# Altium project Pet Pulse.PrjPcb
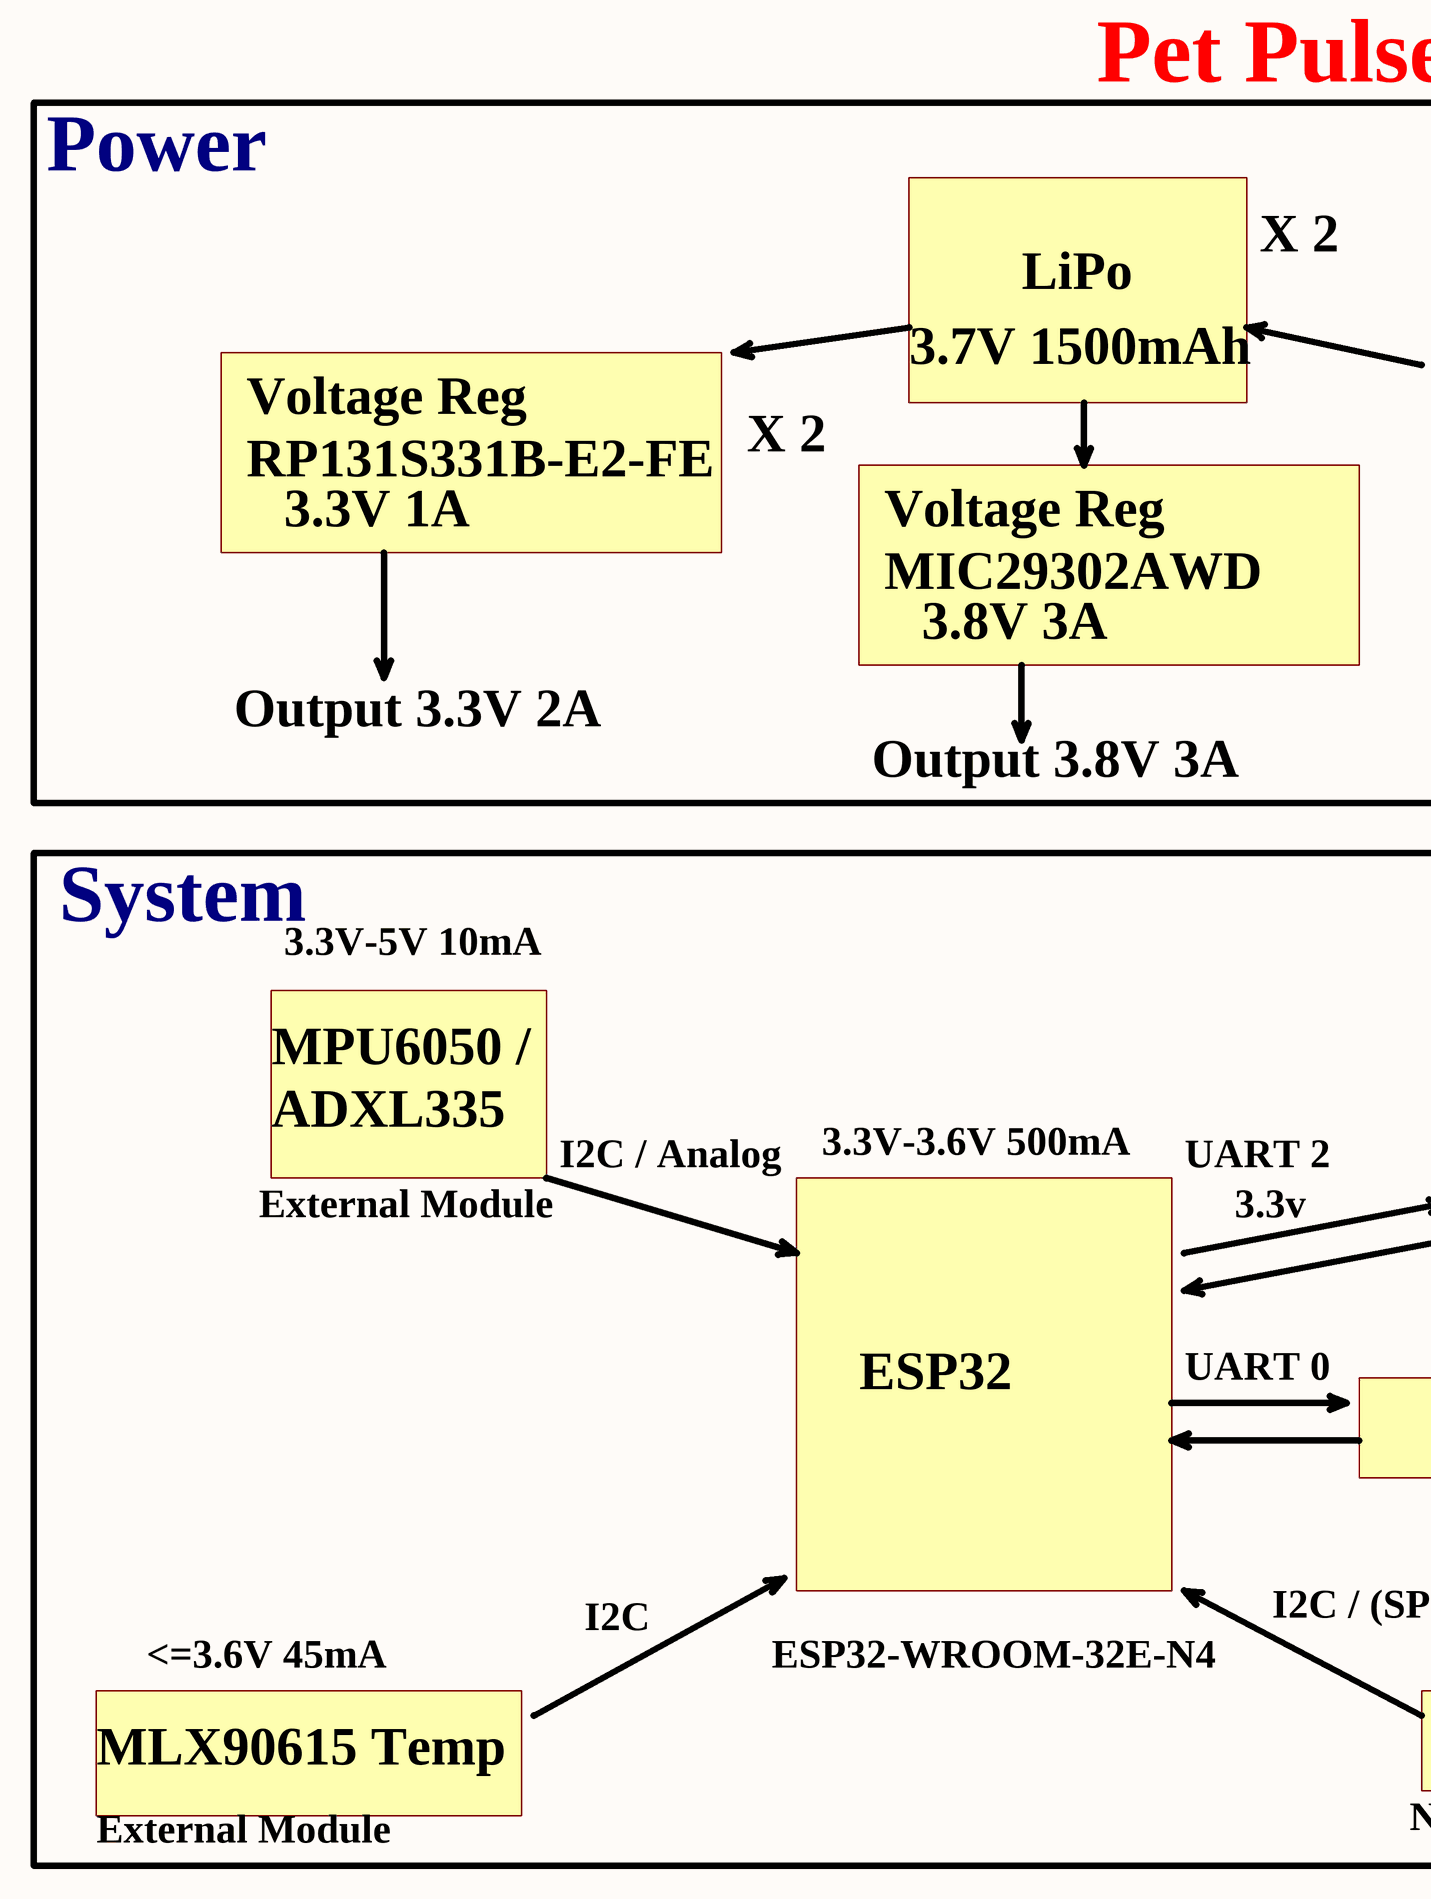
[diagram p0: [01] Block Diagram.SchDoc, left]
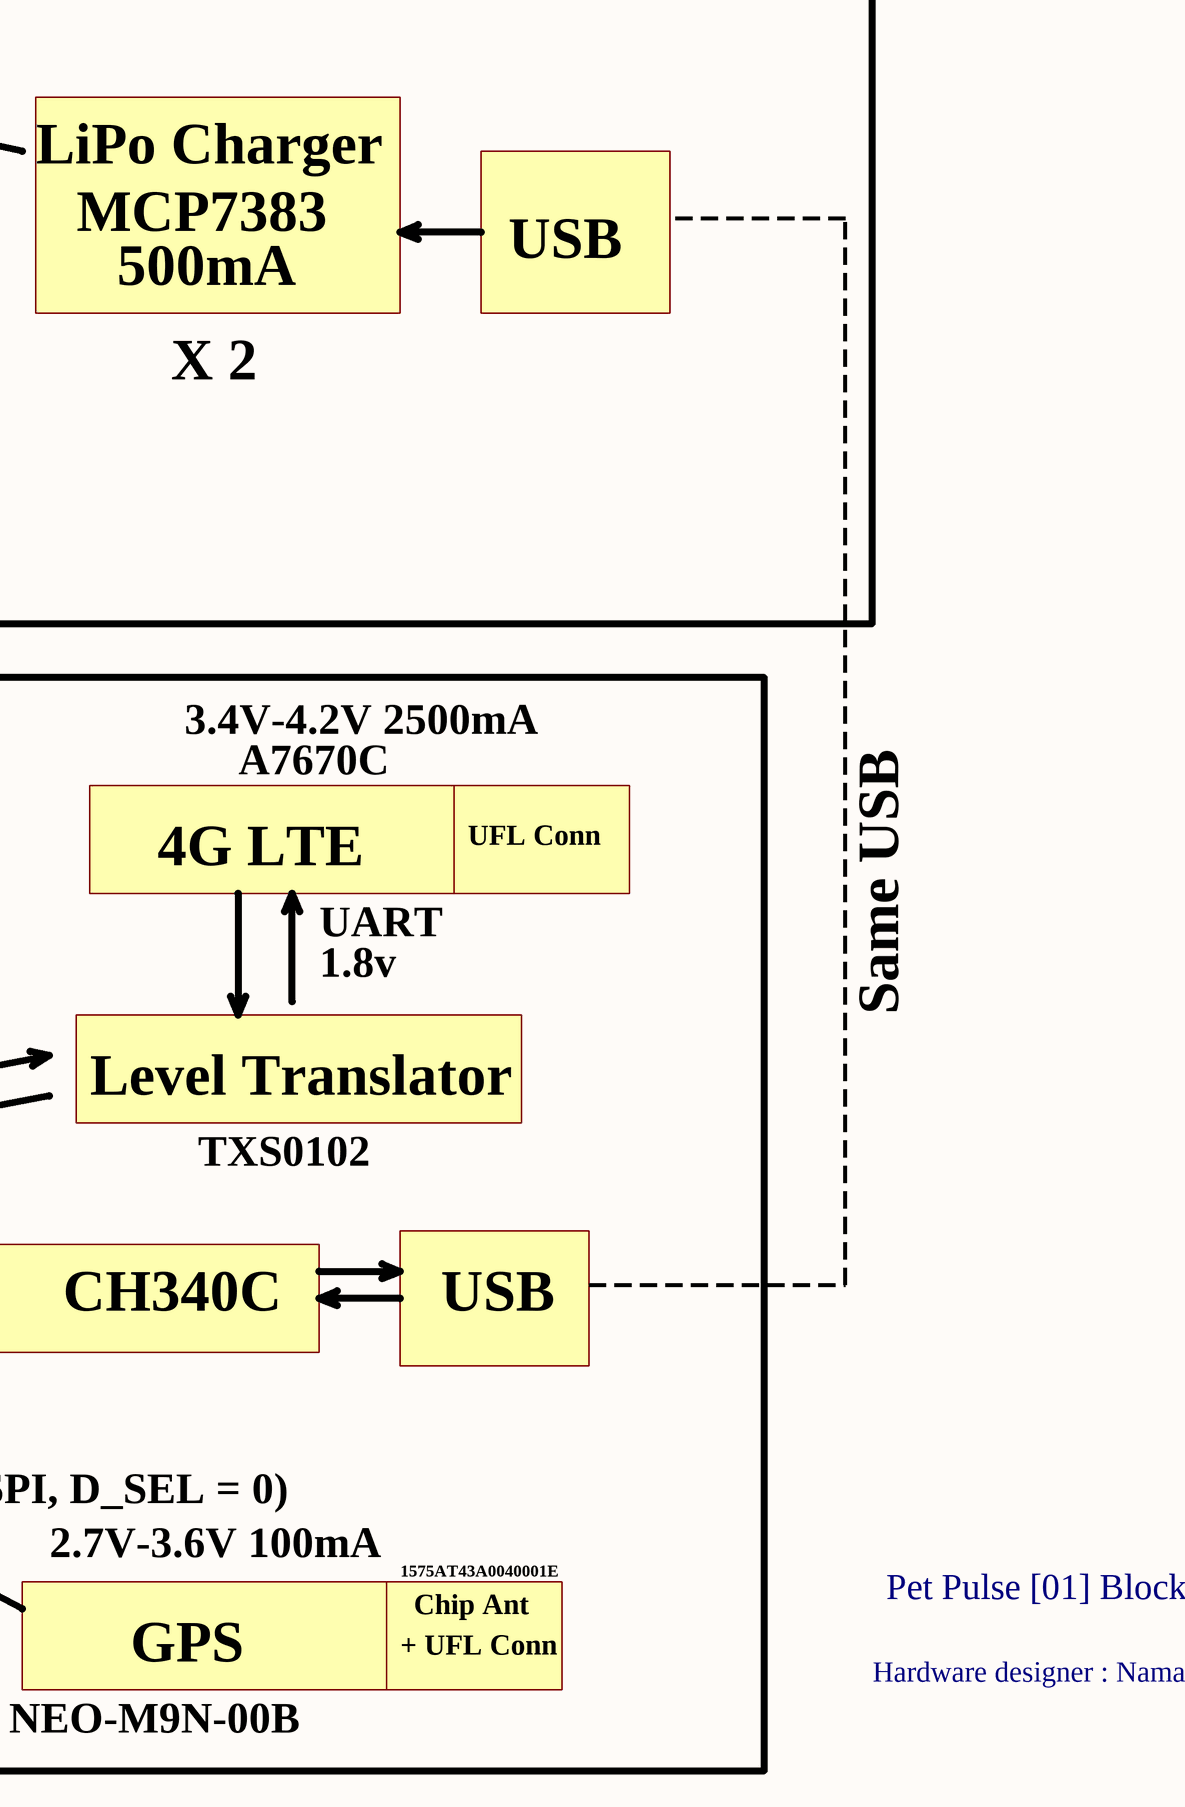
[diagram p1: [01] Block Diagram.SchDoc, right]
6 sheets, 99 parts. Net scope: flat (ports and power ports of the same name join across sheets).
Board file: Pet Pulse PCB.PcbDoc
Sheets:
  [01] Block Diagram.SchDoc
  [02] LDO and LiPo Circuit.SchDoc
  [03] ESP32.SchDoc
  [04] GPS.SchDoc
  [05] External Modules.SchDoc
  [06] LTE - A7670C.SchDoc

## Sheet [01] Block Diagram.SchDoc
size A2; SheetNumber: 1; SheetTotal: 6

### Notes on the sheet
- Pet Pulse
- Power
- LiPo
- X 2
- 3.7V 1500mAh
- Voltage Reg
- LiPo Charger
- RP131S331B-E2-FE
- MCP7383
- 500mA
- USB
- 3.3V 1A
- MIC29302AWD
- 3.8V 3A
- Output 3.3V 2A
- Output 3.8V 3A
- System
- 3.4V-4.2V 2500mA
- 3.3V-5V 10mA
- A7670C
- 4G LTE
- UFL Conn
- MPU6050 /
- UART
- ADXL335
- I2C / Analog
- 3.3V-3.6V 500mA
- UART 2
- 1.8v
- Same USB
- External Module
- 3.3v
- Level Translator
- TXS0102
- ESP32
- UART 0
- CH340C
- I2C / (SPI, D_SEL = 0)
- <=3.6V 45mA
- I2C
- ESP32-WROOM-32E-N4
- 2.7V-3.6V 100mA
- 1575AT43A0040001E
- Chip Ant
- Pet Pulse [01] Block Diagram
- MLX90615 Temp
- GPS
- + UFL Conn
- Hardware designer : Naman Tanwar
- NEO-M9N-00B

## Sheet [02] LDO and LiPo Circuit.SchDoc
size A4; SheetNumber: 2; SheetTotal: 6
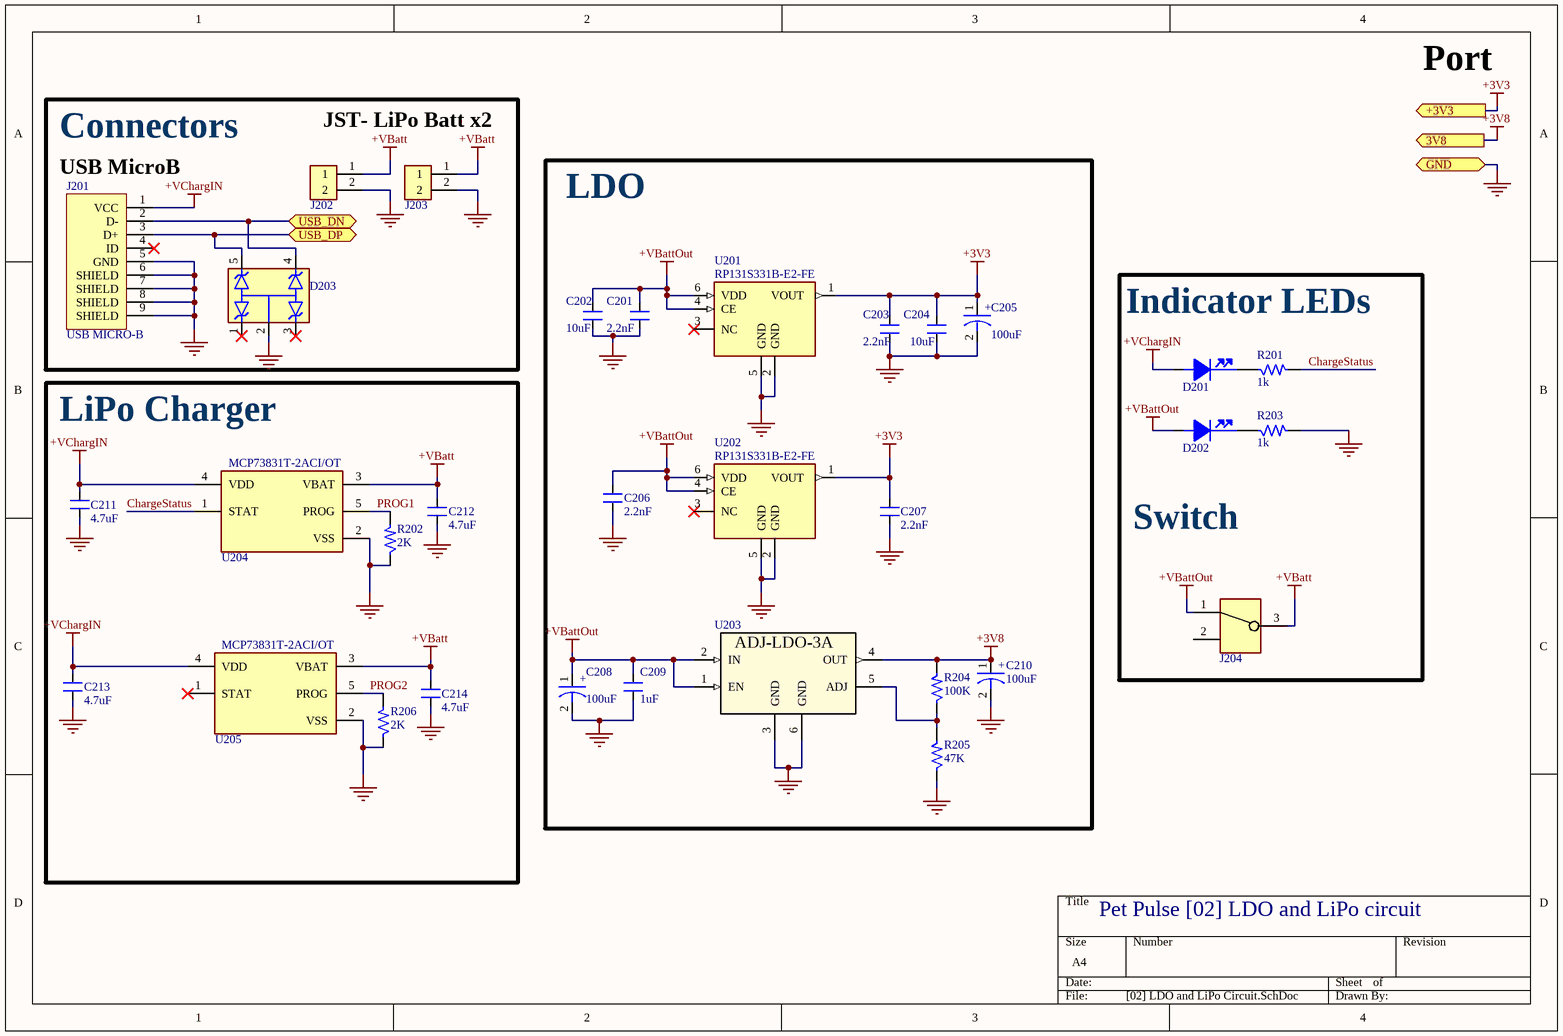
[diagram p2: [02] LDO and LiPo Circuit.SchDoc]

### Parts
C201  2.2nF  [CAP_0805]
C202  10uF  [CAP_1206]
C203  2.2nF  [CAP_0805]
C204  10uF  [CAP_1206]
C205  100uF  [ACAP_P236_D305_H303_RAD]
C206  2.2nF  [CAP_0805]
C207  2.2nF  [CAP_0805]
C208  100uF  [ACAP_P236_D305_H303_RAD]
C209  1uF  [CAP_0805]
C210  100uF  [ACAP_P236_D305_H303_RAD]
C211  4.7uF  [CAP_0805]
C212  4.7uF  [CAP_0805]
C213  4.7uF  [CAP_0805]
C214  4.7uF  [CAP_0805]
D201  LED 0805 ORANGE  [LED_0805]  (value not drawn)
D202  LED 0805 ORANGE  [LED_0805]  (value not drawn)
D203  ESDA6V1W5  [SOT-323-5]  (value not drawn)
J201  USB MICRO-B  [CON_USB2.0_MICROB-SMD]
J202  1x2 JST  [CON-JST-1X2-1.5-M-TH]  (value not drawn)
J203  1x2 JST  [CON-JST-1X2-1.5-M-TH]  (value not drawn)
J204  SW1_SlideSW_SMD_SPDT_450405020524  [SW1_SlideSW_SMD_SPDT_450405020524]  (value not drawn)
R201  1k  [RES_0805]
R202  2K  [RES_0805]
R203  1k  [RES_0805]
R204  100K  [RES_0805]
R205  47K  [RES_0805]
R206  2K  [RES_0805]
U201  RP131S331B-E2-FE  [6HSOP]
U202  RP131S331B-E2-FE  [6HSOP]
U203  MIC29302AWD  [TO-252-5_MCH]  (value not drawn)
U204  MCP73831T-2ACI/OT  [SOT-23-5_MC_MCH]
U205  MCP73831T-2ACI/OT  [SOT-23-5_MC_MCH]

### Blocks framed on the sheet
Connectors: D203 J201-J203
LDO: C201-C210 R204 R205 U201-U203
LiPo Charger: C211-C214 R202 R206 U204 U205

### Ports
3V8 (out, see [05] External Modules[4D], [06] LTE - A7670C[8A]), +3V3 (out, see [03] ESP32[2C], [04] GPS[4B], [05] External Modules[4C], [06] LTE - A7670C[8A]), GND (bidir, see [03] ESP32[2C], [04] GPS[4B], [05] External Modules[4D], [06] LTE - A7670C[8A]), USB_DN (bidir, see [03] ESP32[1D]), USB_DP (bidir, see [03] ESP32[1D])

### Nets
+3V3: C203.1 C204.2 C205.1 C207.1 U201.1(VOUT) U202.1(VOUT) ; port +3V3
+3V8: C210.1 R204.2 U203.4(OUT) ; port 3V8
+VBatt: C212.2 C214.2 J202.1 J203.1 J204.3 U204.3(VBAT) U205.3(VBAT)
+VBattOut: C201.1 C202.2 C206.1 C208.1 C209.2 D202.2(Anode) J204.1 U201.4(CE) U201.6(VDD) U202.4(CE) U202.6(VDD) U203.1(EN) U203.2(IN)
+VChargIN: C211.2 C213.2 D201.2(Anode) J201.1(VCC) U204.4(VDD) U205.4(VDD)
GND: C201.2 C202.1 C203.2 C204.1 C205.2 C206.2 C207.2 C208.2 C209.1 C210.2 C211.1 C212.1 C213.1 C214.1 D203.2 J201.5(GND) J201.6(SHIELD) J201.7(SHIELD) J201.8(SHIELD) J201.9(SHIELD) J202.2 J203.2 R202.1 R203.2 R205.1 R206.1 U201.2(GND) U201.5(GND) U202.2(GND) U202.5(GND) U203.3(GND) U203.6(GND) U204.2(VSS) U205.2(VSS) ; port GND
ChargeStatus: R201.2 U204.1(STAT)
PROG1: R202.2 U204.5(PROG)
PROG2: R206.2 U205.5(PROG)
USB_D_N: D203.4 J201.2(D-) ; port USB_DN
USB_D_P: D203.5 J201.3(D+) ; port USB_DP
NetD201_1: D201.1(Cathode) R201.1
NetD202_1: D202.1(Cathode) R203.1
NetR204_1: R204.1 R205.2 U203.5(ADJ)

Not connected (* = marked no-connect by the designer): D203 1* 3*; J201 4(ID)*; J204 2; U201 3(NC)*; U202 3(NC)*; U205 1(STAT)*

### Notes on the sheet
- Port
- (near J201) USB MicroB
- JST- LiPo Batt x2
- Indicator LEDs
- Switch
- Pet Pulse [02] LDO and LiPo circuit
- (in symbol CAP-P_100uF-25V-20%-RAD) +
- (in symbol REG_LDO_ADJ_3A_MIC29302AWD) ADJ-LDO-3A

### Library data of the parts
C201 C203 C206 C207 = CAP_2.2nF-50V-10%-0805: 2200pF ±10% 50V Ceramic Capacitor C0G, NP0 0805 (2012 Metric); Manufacturer: YAGEO; Manufacturer Part Number: CC0805KRX7R9BB222; Alternate Part Number-1: NA; Case/Package: 0805
C202 C204 = CAP_10uF-50V-10%-1206: 10µF ±10% 50V Ceramic Capacitor X7R 1206 (3216 Metric); Manufacturer: KEMET; Manufacturer Part Number: CL31B106KBHNNNE; Alternate Part Number-1: GRT31CR61H106ME01L; Case/Package: 1206; Supplier-1: SIRICOM; Supplier Part Number-1: CC1206KKX5R9BB106
C205 C208 C210 = CAP-P_100uF-25V-20%-RAD: 100µF 25V Aluminum Electrolytic Capacitors Radial, Can - SMD 1000 Hrs @ 105°C; Manufacturer: Nichicon; Manufacturer Part Number: UWT1E101MCL1GS; Alternate Part Number-1: NA; Case/Package: Radial-SMD; Supplier-1: SP ROAD; Supplier Part Number-1: UWT1E101MCL1GS
C209 = CAP_1uF-50V-5%-0805: 1µF ±5% 50V Ceramic Capacitor X7R 0805 (2012 Metric); Manufacturer: Samsung; Manufacturer Part Number: CC0805JKX7R9BB105; Alternate Part Number-1: 0805F105M500NT; Case/Package: 0805; Supplier-1: SIRICOM; Supplier Part Number-1: CL21B105KBFNNNE
C211-C214 = CAP_4.7uF-50V-10%-0805: 4.7µF ±10% 50V Ceramic Capacitor X5R 0805 (2012 Metric); Manufacturer: Yageo; Manufacturer Part Number: GRM21BR61H475KE51L; Alternate Part Number-1: NA; Case/Package: 0805; Supplier-1: SIRICOM; Supplier Part Number-1: CL21A475KBQNNNE
D201 D202 = LED_ORANGE-2V-20mA- 0805: Orange LED 0805 Vf = 2V, 20mA; Manufacturer: Osram Opto; Manufacturer Part Number: LOR976-PS-1; Lens Color: White; Viewing Angle: 160°; Lens Style: Flat,Rectangular,Diffused,Colorless; Forward Current: 25mA; Luminous Intensity: 162.5mcd; Dominant Wavelength: 606nm; Luminous Flux: 0.735lm; Reverse Voltage: 12V; Lens Transparency: Diffused; Number of LEDs: 1; Lens Size: 1.25mm; Supplier 1: Arrow Electronics; RoHS: Yes; Category: LEDs; Stock 1: 2418; Pricing 1: 1=0.27100, 10=0.15400, 25=0.15270, 100=0.07290, 250=0.07210, 500=0.06600, 1000=0.05150 (USD); Mount: Surface Mount; Case/Package: 0805; Number of Pins: 2; Color: Orange; Case Code (Metric): 2012; Case Code (Imperial): 0805; Contact Plating: Tin,Matte; Min Operating Temperature: -30°C; Max Operating Temperature: 85°C; Packaging: Tape and Reel; Forward Voltage: 2V; Test Current: 20mA; Package Quantity: 16000; Illumination Color: Orange; Series: CHIPLED 0805; Length: 2mm; Width: 1.25mm; Height: 0.9mm; Radiation Hardening: No; RoHS Compliant: Yes; ComponentLink1URL: https://datasheet.ciiva.com/2119/00078881-0-2119287.pdf?src-supplier=Digi-Key; ComponentLink1Description: https://datasheet.ciiva.com/2119/00078881-0-2119287.pdf?src-supplier=Digi-Key; ComponentLink2URL: https://datasheet.ciiva.com/2119/00078881-0-2119286.pdf?src-supplier=Digi-Key; ComponentLink2Description: https://datasheet.ciiva.com/2119/00078881-0-2119286.pdf?src-supplier=Digi-Key; ComponentLink3URL: https://datasheet.ciiva.com/2119/00078881-0-2119288.pdf?src-supplier=Digi-Key; ComponentLink3Description: https://datasheet.ciiva.com/2119/00078881-0-2119288.pdf?src-supplier=Digi-Key; Supplier Part Number 1: LO R976-PS-1
D203 = DIO_TVS_ARRY_3Vrm_6.1Vbr_ESDA6V1W5: Tvs Diode Array 3V reverse standoff, 6.1V reverse breakdown.  SOT-323-5; Manufacturer: STMicroelectronics; Manufacturer Part Number: ESDA6V1W5; Case/Package: SOT-323-5
J201 = CON_USB2.0_MICROB-SMD: USB - micro B USB 2.0 Receptacle Connector 5 Position Surface Mount, Right Angle; Manufacturer: ICC; Manufacturer Part Number: 10118192-0001LF; Alternate Part Number-1: NA; Case/Package: USB MICRO-B SMD; Supplier-1: SUNROM; Supplier Part Number-1: MICRO USB
J202 J203 = CON-JST-1X2-1.5-M-TH: Connector Header Through Hole 2 position 0.059" (1.50mm); Manufacturer: JST Sales America Inc.; Manufacturer Part Number: B2B-ZR (LF)(SN); Supplier 1: Digi-Key; Category: Headers and Wire Housings; Supplier Part Number 1: 455-B2B-ZR-ND; ComponentLink1Description: DigiKey; ComponentLink1URL: https://www.digikey.in/en/products/detail/jst-sales-america-inc/B2B-ZR/926564
J204 = SW1_SlideSW_SMD_SPDT_450405020524: Slide Switch SPDT Surface Mount; Manufacturer: Würth Elektronik; Manufacturer Part Number: 450405020524; Case/Package: SMT
R201 R203 = RES_1K- 0.125W-5%-0805: RES 1K OHM 5% 1/8W 0805; Manufacturer Part Number: RC0805JR-131KL; Manufacturer: YAGEO; Alternate Part Number: NA; Case/Package: 0805
R202 R206 = RES_2K-0.125W-1%-0805: 2 kOhms ±1% 0.125W, 1/8W Chip Resistor 0805 (2012 Metric) Moisture Resistant Thick Film; Manufacturer: TE Connectivity; Manufacturer Part Number: RC0805FR-072KL; Alternate Part Number-1: NA; Case/Package: 0805; Supplier-1: SIRICOM; Supplier Part Number-1: WR08X2001FTL
R204 = RES_100K-0.125W-1%-0805: 100 kOhms ±1% 0.125W, 1/8W Chip Resistor 0805 (2012 Metric) Automotive AEC-Q200 Thick Film; Manufacturer: Walsin; Manufacturer Part Number: WR08X1003FTL; Alternate Part Number-1: NA; Case/Package: 0805; Supplier-1: SIRICOM; Supplier Part Number-1: WR08X1003FTL
R205 = RES_47K-0.125W-1%-0805: 47 kOhms ±1% 0.125W, 1/8W Chip Resistor 0805 (2012 Metric) Moisture Resistant Thick Film; Manufacturer: YAGEO; Manufacturer Part Number: RC0805FR-0747KL; Case/Package: 0805
U201 U202 = REG_LDO_3.3V_1A_RP131S331B-E2-FE: LDO 3.3V Output 1A 6-HSOP-J; Manufacturer: Nisshinbo Micro Devices Inc.; Manufacturer Part Number: RP131S331B-E2-FE; Case/Package: 6HSOP
U203 = REG_LDO_ADJ_3A_MIC29302AWD: Linear Voltage Regulator IC Positive Adjustable 1 Output 3A TO-252-5; Microchip Technology: Microchip; Manufacturer Part Number: MIC29302AWD; Case/Package: TO-252-5
U204 U205 = IC_BATT_CNTL_LI-ION-1CELL: Charger IC Lithium Ion/Polymer SOT-23-5; Manufacturer: Microchip; Manufacturer Part Number: MCP73831T-2ACI/OT; Case/Package: SOT-23-5

## Sheet [03] ESP32.SchDoc
size A4; SheetNumber: 3; SheetTotal: 6
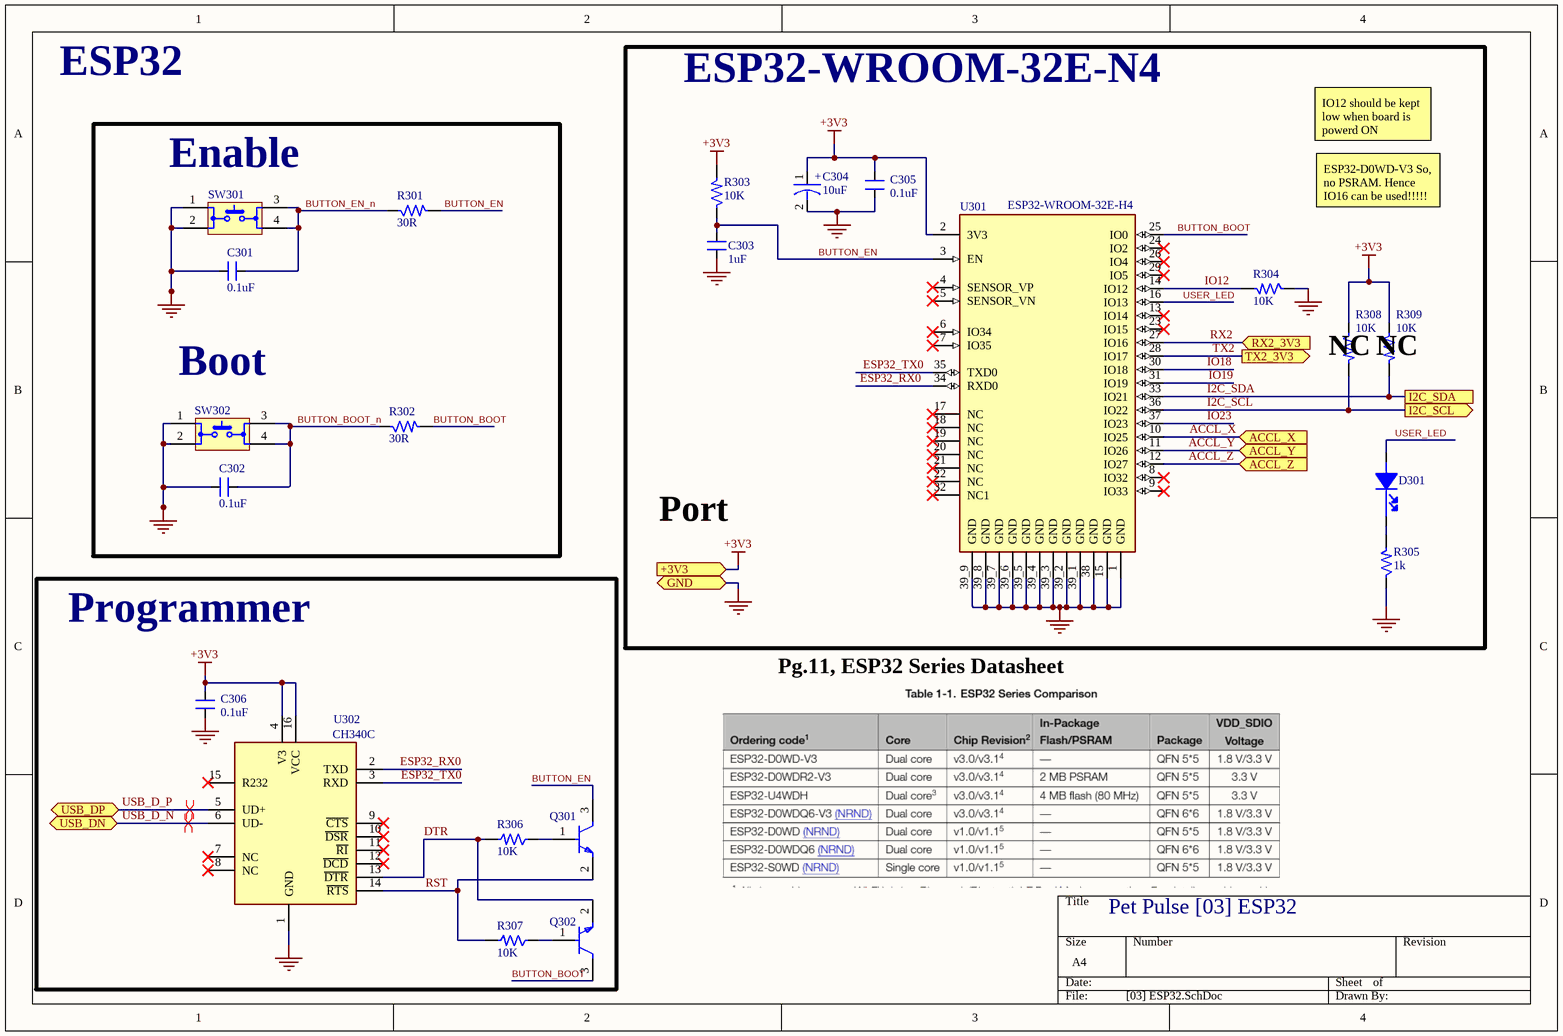
[diagram p3: [03] ESP32.SchDoc]

### Parts
C301  0.1uF  [CAP_0805]
C302  0.1uF  [CAP_0805]
C303  1uF  [CAP_0805]
C304  10uF  [CAP-T_1206]
C305  0.1uF  [CAP_0805]
C306  0.1uF  [CAP_0805]
D301  LED 0805 ORANGE  [LED_0805]  (value not drawn)
Q301  MMBT3904-7-F  [FP-SOT23-MFG]  (value not drawn)
Q302  MMBT3904-7-F  [FP-SOT23-MFG]  (value not drawn)
R301  30R  [RES_0805]
R302  30R  [RES_0805]
R303  10K  [RES_0805]
R304  10K  [RES_0805]
R305  1k  [RES_0805]
R306  10K  [RES_0805]
R307  10K  [RES_0805]
R308  10K  [RES_0805]
R309  10K  [RES_0805]
SW301  SW1_SMD_TL3305AF260QG  [SW_TL3305AF260QG]  (value not drawn)
SW302  SW1_SMD_TL3305AF260QG  [SW_TL3305AF260QG]  (value not drawn)
U301  ESP32-WROOM-32E-H4  [MOD_ESP32-WROOM-32E_(4MB_HIGH_TEMP)]
U302  CH340C  [SOIC16_50_284_25X90_SMT]

### Blocks framed on the sheet
ESP32-WROOM-32E-N4: C303-C305 D301 R303-R305 R308 R309 U301
Programmer: C306 Q301 Q302 R306 R307 U302

### Ports
+3V3 (in, see [02] LDO and LiPo Circuit[4A], [04] GPS[4A], [05] External Modules[4A], [06] LTE - A7670C[8A]), ACCL_X (in, see [05] External Modules[2B]), ACCL_Y (in, see [05] External Modules[2B]), ACCL_Z (in, see [05] External Modules[2B]), GND (bidir, see [02] LDO and LiPo Circuit[4A], [04] GPS[4A], [05] External Modules[4A], [06] LTE - A7670C[8A]), I2C_SCL (out, see [04] GPS[1B], [05] External Modules[3B]), I2C_SDA (see [04] GPS[1B], [05] External Modules[3B]), RX2_3V3 (in, see [06] LTE - A7670C[6B]), TX2_3V3 (out, see [06] LTE - A7670C[6B]), USB_DN (bidir, see [02] LDO and LiPo Circuit[1A]), USB_DP (bidir, see [02] LDO and LiPo Circuit[1A])

### Nets
+3V3: C304.1 C305.2 C306.2 R303.2 R308.1 R309.1 U301.2(3V3) U302.4(V3) U302.16(VCC) ; port +3V3
GND: C301.2 C302.2 C303.1 C304.2 C305.1 C306.1 R304.1 R305.1 SW301.1 SW301.2 SW302.1 SW302.2 U301.1(GND) U301.15(GND) U301.38(GND) U301.39_1(GND) U301.39_2(GND) U301.39_3(GND) U301.39_4(GND) U301.39_5(GND) U301.39_6(GND) U301.39_7(GND) U301.39_8(GND) U301.39_9(GND) U302.1(GND) ; port GND
ACCL_X: U301.10(IO25) ; port ACCL_X
ACCL_Y: U301.11(IO26) ; port ACCL_Y
ACCL_Z: U301.12(IO27) ; port ACCL_Z
BUTTON_BOOT: Q302.3(C) R302.2 U301.25(IO0)
BUTTON_BOOT_n: C302.1 R302.1 SW302.3 SW302.4
BUTTON_EN: C303.2 Q301.3(C) R301.2 R303.1 U301.3(EN)
BUTTON_EN_n: C301.1 R301.1 SW301.3 SW301.4
DTR: Q302.2(E) R306.2 U302.13(~{DTR})
ESP32_RX0: U301.34(RXD0) U302.2(TXD)
ESP32_TX0: U301.35(TXD0) U302.3(RXD)
I2C_SCL: R308.2 U301.36(IO22) ; port I2C_SCL
I2C_SDA: R309.2 U301.33(IO21) ; port I2C_SDA
IO12: R304.2 U301.14(IO12)
IO18: U301.30(IO18)
IO19: U301.31(IO19)
IO23: U301.37(IO23)
RST: Q301.2(E) R307.2 U302.14(~{RTS})
RX2: U301.27(IO16) ; port RX2_3V3
TX2: U301.28(IO17) ; port TX2_3V3
USB_D_N: U302.6(UD-) ; port USB_DN
USB_D_P: U302.5(UD+) ; port USB_DP
USER_LED: D301.2(Anode) U301.16(IO13)
NetD301_1: D301.1(Cathode) R305.2
NetQ301_1: Q301.1(B) R306.1
NetQ302_1: Q302.1(B) R307.1

Not connected (* = marked no-connect by the designer): U301 4(SENSOR_VP)* 5(SENSOR_VN)* 6(IO34)* 7(IO35)* 8(IO32)* 9(IO33)* 13(IO14)* 17(NC)* 18(NC)* 19(NC)* 20(NC)* 21(NC)* 22(NC)* 23(IO15)* 24(IO2)* 26(IO4)* 29(IO5)* 32(NC1)*; U302 7(NC)* 8(NC)* 9(~{CTS})* 10(~{DSR})* 11(~{RI})* 12(~{DCD})* 15(R232)*

### Layout directives
differential pair; differential pair class DIFF90: USB_D_N, USB_D_P

### Notes on the sheet
- ESP32
- (near SW301) Enable
- IO12 should be kept low when board is powerd ON
- ESP32-D0WD-V3 So, no PSRAM. Hence IO16 can be used!!!!!
- (near SW302) Boot
- (near R308) NC
- (near R309) NC
- Port
- Pg.11, ESP32 Series Datasheet
- Pet Pulse [03] ESP32
- (in symbol CAP-P_10uF-16V-10%-1206) +

### Library data of the parts
C301 C302 C305 C306 = CAP_0.1uF-50V-10%-0805: 0.1µF ±10% 50V Ceramic Capacitor X7R 0805 (2012 Metric); Manufacturer: Samsung; Manufacturer Part Number: CL21B104KBCNNNC; Alternate Part Number-1: NA; Case/Package: 0805; Supplier-1: SIRICOM; Supplier Part Number-1: 0805B104K500CT
C303 = CAP_1uF-50V-5%-0805: as C209 on sheet [02] LDO and LiPo Circuit; Case/Package: 0805; Supplier-1: SIRICOM; Supplier Part Number-1: CL21B105KBFNNNE
C304 = CAP-P_10uF-16V-10%-1206: 10µF Molded Tantalum Capacitors 16V 1206 (3216 Metric) 3Ohm; Manufacturer: AVX Corporation; Manufacturer Part Number: TAJA106K016SNJ; Alternate Part Number-1: CA45-A016K106T; Case/Package: 1206; Supplier-1: SIRICOM; Supplier Part Number-1: TAJA106K016SNJ
D301 = LED_ORANGE-2V-20mA- 0805: as D201 on sheet [02] LDO and LiPo Circuit; Supplier 1: Arrow Electronics; RoHS: Yes; Category: LEDs; Stock 1: 2418; Pricing 1: 1=0.27100, 10=0.15400, 25=0.15270, 100=0.07290, 250=0.07210, 500=0.06600, 1000=0.05150 (USD); Mount: Surface Mount; Case/Package: 0805; Number of Pins: 2; Color: Orange; Case Code (Metric): 2012; Case Code (Imperial): 0805; Contact Plating: Tin,Matte; Min Operating Temperature: -30°C; Max Operating Temperature: 85°C; Packaging: Tape and Reel; Forward Voltage: 2V; Test Current: 20mA; Package Quantity: 16000; Illumination Color: Orange; Series: CHIPLED 0805; Length: 2mm; Width: 1.25mm; Height: 0.9mm; Radiation Hardening: No; RoHS Compliant: Yes; ComponentLink1URL: https://datasheet.ciiva.com/2119/00078881-0-2119287.pdf?src-supplier=Digi-Key; ComponentLink1Description: https://datasheet.ciiva.com/2119/00078881-0-2119287.pdf?src-supplier=Digi-Key; ComponentLink2URL: https://datasheet.ciiva.com/2119/00078881-0-2119286.pdf?src-supplier=Digi-Key; ComponentLink2Description: https://datasheet.ciiva.com/2119/00078881-0-2119286.pdf?src-supplier=Digi-Key; ComponentLink3URL: https://datasheet.ciiva.com/2119/00078881-0-2119288.pdf?src-supplier=Digi-Key; ComponentLink3Description: https://datasheet.ciiva.com/2119/00078881-0-2119288.pdf?src-supplier=Digi-Key; Supplier Part Number 1: LO R976-PS-1
Q301 Q302 = TRANS_NPN_MMBT3904: TRANS NPN 40V 0.2A SMD SOT23-3; Manufacturer: Diodes Incorporated; Frequency: 300MHz; Power Dissipation: 350mW; Element Configuration: Single; Max Power Dissipation: 300mW; Max Collector Current: 200mA; Collector Emitter Saturation Voltage: 300mV; Number of Elements: 1; hFE Min: 100; Collector Base Voltage (VCBO): 60V; Emitter Base Voltage (VEBO): 6V; Contact Plating: Tin; Package Quantity: 3000; Max Frequency: 300MHz; REACH SVHC: No SVHC; Max Operating Temperature: 150°C; Width: 1.4mm; Collector Emitter Voltage (VCEO): 40V; Voltage Rating (DC): 40V; Radiation Hardening: No; Case/Package: SOT-23; Height: 1mm; Collector Emitter Breakdown Voltage: 40V; Length: 3.05mm; Polarity: NPN; Packaging: Tape and Reel; Number of Pins: 3; Min Operating Temperature: -55°C; Gain Bandwidth Product: 300MHz; Mount: Surface Mount; Weight: 0.000282oz; Continuous Collector Current: 200mA; Transition Frequency: 300MHz; Max Breakdown Voltage: 40V; Lead Free: Lead Free; Manufacturer Part Number: MMBT3904-7-F
R301 R302 = RES_30R-0.125W-5%-0805: 30 Ohms ±5% 0.125W, 1/8W Chip Resistor 0805 (2012 Metric) Moisture Resistant Thick Film; Manufacturer: Stackpole Electronics; Manufacturer Part Number: RC0805JR-0730RL; Alternate Part Number-1: NA; Case/Package: 0805; Supplier-1: SIRICOM; Supplier Part Number-1: WR08X30R0FTL
R303 R304 R306-R309 = RES_10K-0.125W-1%-0805: 10 kOhms ±1% 0.125W, 1/8W Chip Resistor 0805 (2012 Metric) Automotive AEC-Q200 Thick Film; Manufacturer: CTS; Manufacturer Part Number: WR08X1002FTL; Case/Package: 0805; Supplier-1: SIRICOM; Supplier Part Number-1: WR08X1002FTL; Alternate Part Number-1: WR08X1002FTL
R305 = RES_1K- 0.125W-5%-0805: as R201 on sheet [02] LDO and LiPo Circuit; Case/Package: 0805
SW301 SW302 = SW1_SMD_TL3305AF260QG: Tactile Switch SPST SMD; Manufacturer: E-Switch; Manufacturer Part Number: TL3305AF260QG; Case/Package: SMD
U301 = MOD-ESP32-WROOM-32E-H4: Rx Txrx Mod Wifi Trace Ant SMD; Manufacturer: Espressif Systems; Supplier 1: Digi-Key; Manufacturer Part Number: ESP32-WROOM-32E-H4; RoHS: No; Category: Uncategorized; Stock 1: 12159; Pricing 1: 1=3.15000 (USD); Supplier Part Number 1: 1965-ESP32-WROOM-32E-H4CT-ND
U302 = IC_CH340C: USB Bridge, USB to UART USB 2.0 UART Interface; Manufacturer: Olimex; Alternate Part Number-1: NA; Manufacturer Part Number: CH340C; Case/Package: SOIC16; Supplier-1: LCSC; Supplier Part Number-1: C84681

## Sheet [04] GPS.SchDoc
size A4; SheetNumber: 4; SheetTotal: 6
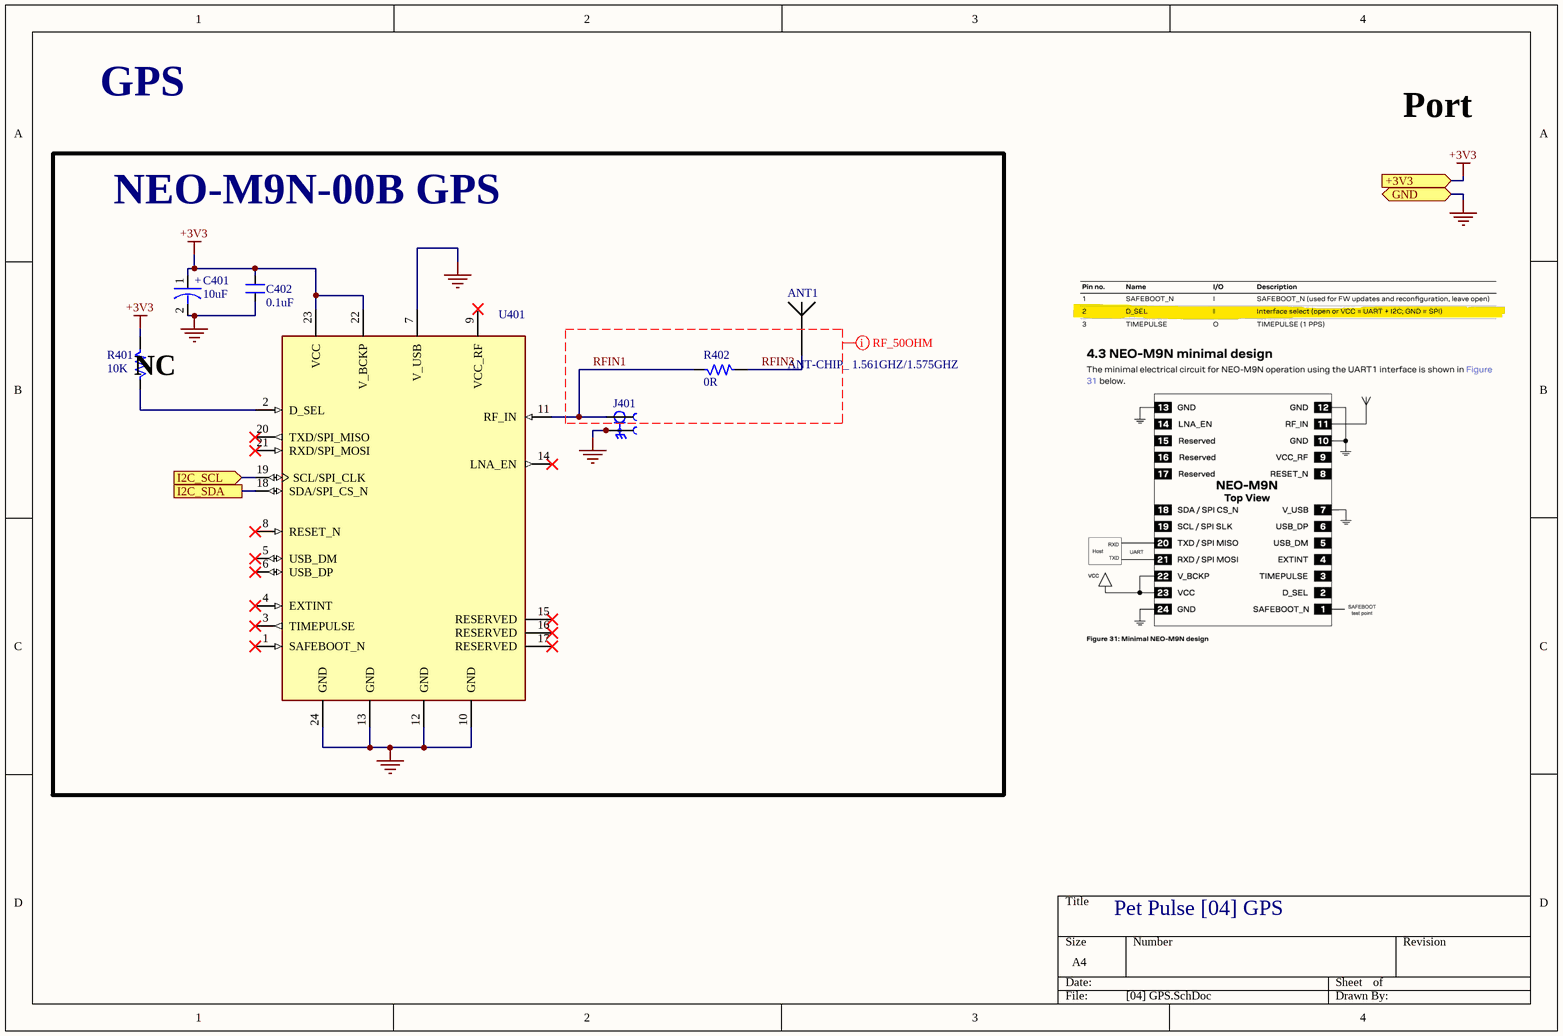
[diagram p4: [04] GPS.SchDoc]

### Parts
ANT1  ANT-CHIP_ 1.561GHZ/1.575GHZ  [ANT_1575AT43A0040001E]
C401  10uF  [CAP-T_1206]
C402  0.1uF  [CAP_0805]
J401  CON_UFL-SMD-T  [CON-UFL-SMD-T]  (value not drawn)
R401  10K  [RES_0805]
R402  0R  [RES_0603]
U401  IC_GPS/GNSS_NEO-M9N-00B  [IC_NEO-M9N-00B]  (value not drawn)

### Ports
+3V3 (in, see [02] LDO and LiPo Circuit[4A], [03] ESP32[2C], [05] External Modules[4A], [06] LTE - A7670C[8A]), GND (bidir, see [02] LDO and LiPo Circuit[4A], [03] ESP32[2C], [05] External Modules[4A], [06] LTE - A7670C[8A]), I2C_SCL (in, see [03] ESP32[4B], [05] External Modules[3B]), I2C_SDA (see [03] ESP32[4B], [05] External Modules[3B])

### Nets
+3V3: C401.1 C402.2 R401.2 U401.22(V_BCKP) U401.23(VCC) ; port +3V3
GND: C401.2 C402.1 J401.2 J401.3 U401.7(V_USB) U401.10(GND) U401.12(GND) U401.13(GND) U401.24(GND) ; port GND
I2C_SCL: U401.19(SCL/SPI_CLK) ; port I2C_SCL
I2C_SDA: U401.18(SDA/SPI_CS_N) ; port I2C_SDA
RFIN1: J401.1 R402.1 U401.11(RF_IN)
RFIN2: ANT1.1 R402.2
NetR401_1: R401.1 U401.2(D_SEL)

Not connected (* = marked no-connect by the designer): U401 1(SAFEBOOT_N)* 3(TIMEPULSE)* 4(EXTINT)* 5(USB_DM)* 6(USB_DP)* 8(RESET_N)* 9(VCC_RF)* 14(LNA_EN)* 15(RESERVED)* 16(RESERVED)* 17(RESERVED)* 20(TXD/SPI_MISO)* 21(RXD/SPI_MOSI)*

### Layout directives
net class RF_50: RFIN1, RFIN2

### Notes on the sheet
- GPS
- Port
- NEO-M9N-00B GPS
- (near R401) NC
- Pet Pulse [04] GPS
- (in symbol CAP-P_10uF-16V-10%-1206) +

### Library data of the parts
ANT1 = ANT-CHIP_ 1.561GHZ/1.575GHZ: Manufacturer: Johanson Technology Inc.; Manufacturer Part Number: 1575AT43A0040E; Case/Package: SMD
C401 = CAP-P_10uF-16V-10%-1206: as C304 on sheet [03] ESP32; Case/Package: 1206; Supplier-1: SIRICOM; Supplier Part Number-1: TAJA106K016SNJ
C402 = CAP_0.1uF-50V-10%-0805: as C301 on sheet [03] ESP32; Case/Package: 0805; Supplier-1: SIRICOM; Supplier Part Number-1: 0805B104K500CT
J401 = CON_UFL-SMD-T: U.FL (UMCC) Connector Jack, Male Pin 50Ohm Surface Mount Solder; MP: CONUFL001-SMD-T; MF: Linx; Price: None; Package: None; Value: *; Check_prices: https://www.snapeda.com/parts/CONUFL001-SMD-T/Linx/view-part/?ref=eda; Availability: Unavailable; SnapEDA_Link: https://www.snapeda.com/parts/CONUFL001-SMD-T/Linx/view-part/?ref=snap
R401 = RES_10K-0.125W-1%-0805: as R303 on sheet [03] ESP32; Case/Package: 0805; Supplier-1: SIRICOM; Supplier Part Number-1: WR08X1002FTL; Alternate Part Number-1: WR08X1002FTL
R402 = RES_0R-0.1W-0603: 0 Ohms 0603 (1608 Metric); Manufacturer: Stackpole Electronics Inc; Manufacturer Part Number: RMCF0603ZT0R00; Alternate Part Number-1: NA; Case/Package: 0603; Supplier-1: Digi-Key; Supplier Part Number-1: RMCF0603ZT0R00CT-ND
U401 = IC_GPS/GNSS_NEO-M9N-00B: M9 RF Receiver BeiDou, Galileo, GLONASS, GNSS, GPS -167dBm Module; Manufacturer: u-blox; Manufacturer Part Number: NEO-M9N-00B; Case/Package: SMD

## Sheet [05] External Modules.SchDoc
size A4; SheetNumber: 5; SheetTotal: 6
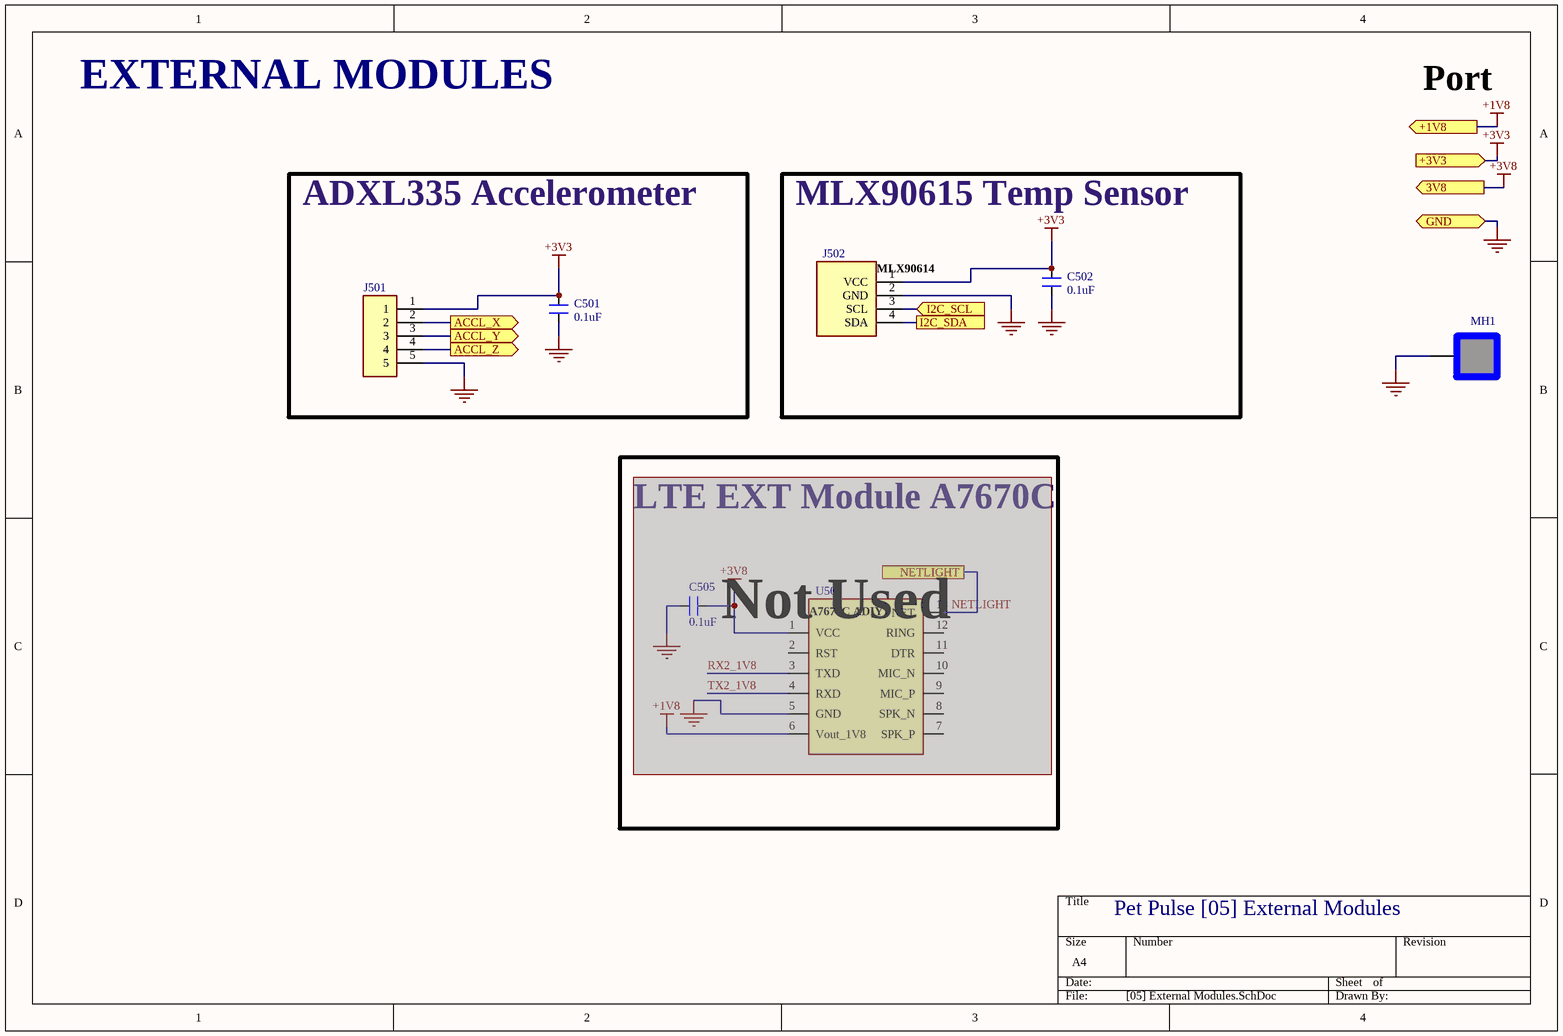
[diagram p5: [05] External Modules.SchDoc]

### Parts
C501  0.1uF  [CAP_0805]
C502  0.1uF  [CAP_0805]
C505  0.1uF  [CAP_0805]  (masked out: inside a compile mask, not in the netlist)
J501  1X5 Berg Male  [CON-BS-SMD-1X5-2.54-M-TH]  (value not drawn)
J502  1X4 Berg Male With MLX90614 3D Body  [MOD_IR_MLX90614_WITH_CON-BS-SMD-1X4-2.54-M-TH]  (value not drawn)
MH1  MH_Square_4MMC_2.2MMD  [MH_Square_4mm_2.2mmD]  (value not drawn)  (no BOM)
U502  A7670C_MOD  [MOD_ADIY_A7670C_BreakoutBoard]  (value not drawn)  (masked out: inside a compile mask, not in the netlist)

### Blocks framed on the sheet
ADXL335 Accelerometer: C501 J501
MLX90615 Temp Sensor: C502 J502
Not Used: C505 U502

### Ports
3V8 (out, see [02] LDO and LiPo Circuit[4A], [06] LTE - A7670C[8A]), +1V8 (out, see [06] LTE - A7670C[8B]), +3V3 (in, see [02] LDO and LiPo Circuit[4A], [03] ESP32[2C], [04] GPS[4A], [06] LTE - A7670C[8A]), ACCL_X (out, see [03] ESP32[4B]), ACCL_Y (out, see [03] ESP32[4B]), ACCL_Z (out, see [03] ESP32[4B]), GND (bidir, see [02] LDO and LiPo Circuit[4A], [03] ESP32[2C], [04] GPS[4A], [06] LTE - A7670C[8A]), I2C_SCL (in, see [03] ESP32[4B], [04] GPS[1B]), I2C_SDA (see [03] ESP32[4B], [04] GPS[1B]), NETLIGHT (see [06] LTE - A7670C[1D], [06] LTE - A7670C[4B])

### Nets
+3V3: C501.2 C502.2 J501.1 J502.1(VCC) ; port +3V3
GND: C501.1 C502.1 J501.5 J502.2(GND) MH1.1 ; port GND
ACCL_X: J501.2 ; port ACCL_X
ACCL_Y: J501.3 ; port ACCL_Y
ACCL_Z: J501.4 ; port ACCL_Z
I2C_SCL: J502.3(SCL) ; port I2C_SCL
I2C_SDA: J502.4(SDA) ; port I2C_SDA

### Notes on the sheet
- EXTERNAL MODULES
- Port
- LTE EXT Module A7670C
- Pet Pulse [05] External Modules
- (in symbol MOD-ADIY_A7670C_LTE_Breakout_Board) A7670C ADIY
- (in symbol MOD_IR_MLX90614_WITH_CON-BS-SMD-1X4-2.54-M-TH) MLX90614

### Library data of the parts
C501 C502 = CAP_0.1uF-50V-10%-0805: as C301 on sheet [03] ESP32; Case/Package: 0805; Supplier-1: SIRICOM; Supplier Part Number-1: 0805B104K500CT
C505 = CAP_0.1uF-50V-5%-0805: 0.1µF ±5% 50V Ceramic Capacitor X7R 0805 (2012 Metric); Manufacturer: AVX Corporation; Manufacturer Part Number: 08055C104JAT4A; Alternate Part Number-1: 0805B104M500; Case/Package: 0805; Supplier-1: SIRICOM; Supplier Part Number-1: 0805B104J500CT
J501 = CON-BS-SMD-1X5-2.54-M-TH_1: 1X5 Berg Strip SMD Male Conn 2.54mm; Manufacturer: Amphenol Communications Solutions; Manufacturer Part Number: 10129380-905001ALF; Supplier 1: Digi-Key; RoHS: No; Category: Connectors; Stock 1: 5335; Pricing 1: 1=1.00000, 10=0.84300, 100=0.75660, 500=0.61902 (USD); Supplier Part Number 1: 609-4535-1-ND
J502 = MOD_IR_MLX90614_WITH_CON-BS-SMD-1X4-2.54-M-TH: 1X4 Berg Strip SMD Male Conn 2.54mm with 3D body of MLX90614 IR Temperature Sensor; Manufacturer: Amphenol Communications Solutions; Manufacturer Part Number: 10129380-904001ALF; Supplier 1: Digi-Key; RoHS: No; Category: Connectors; Stock 1: 5335; Pricing 1: 1=1.00000, 10=0.84300, 100=0.75660, 500=0.61902 (USD); Supplier Part Number 1: 609-4535-1-ND
MH1 = MH_Square_4MMC_2.2MMD: Mounting Hole 4mm Side, 2.2mm Drill
U502 = MOD-ADIY_A7670C_LTE_Breakout_Board: ADIY LTE Module A7670C

## Sheet [06] LTE - A7670C.SchDoc
size A3; SheetNumber: 6; SheetTotal: 6
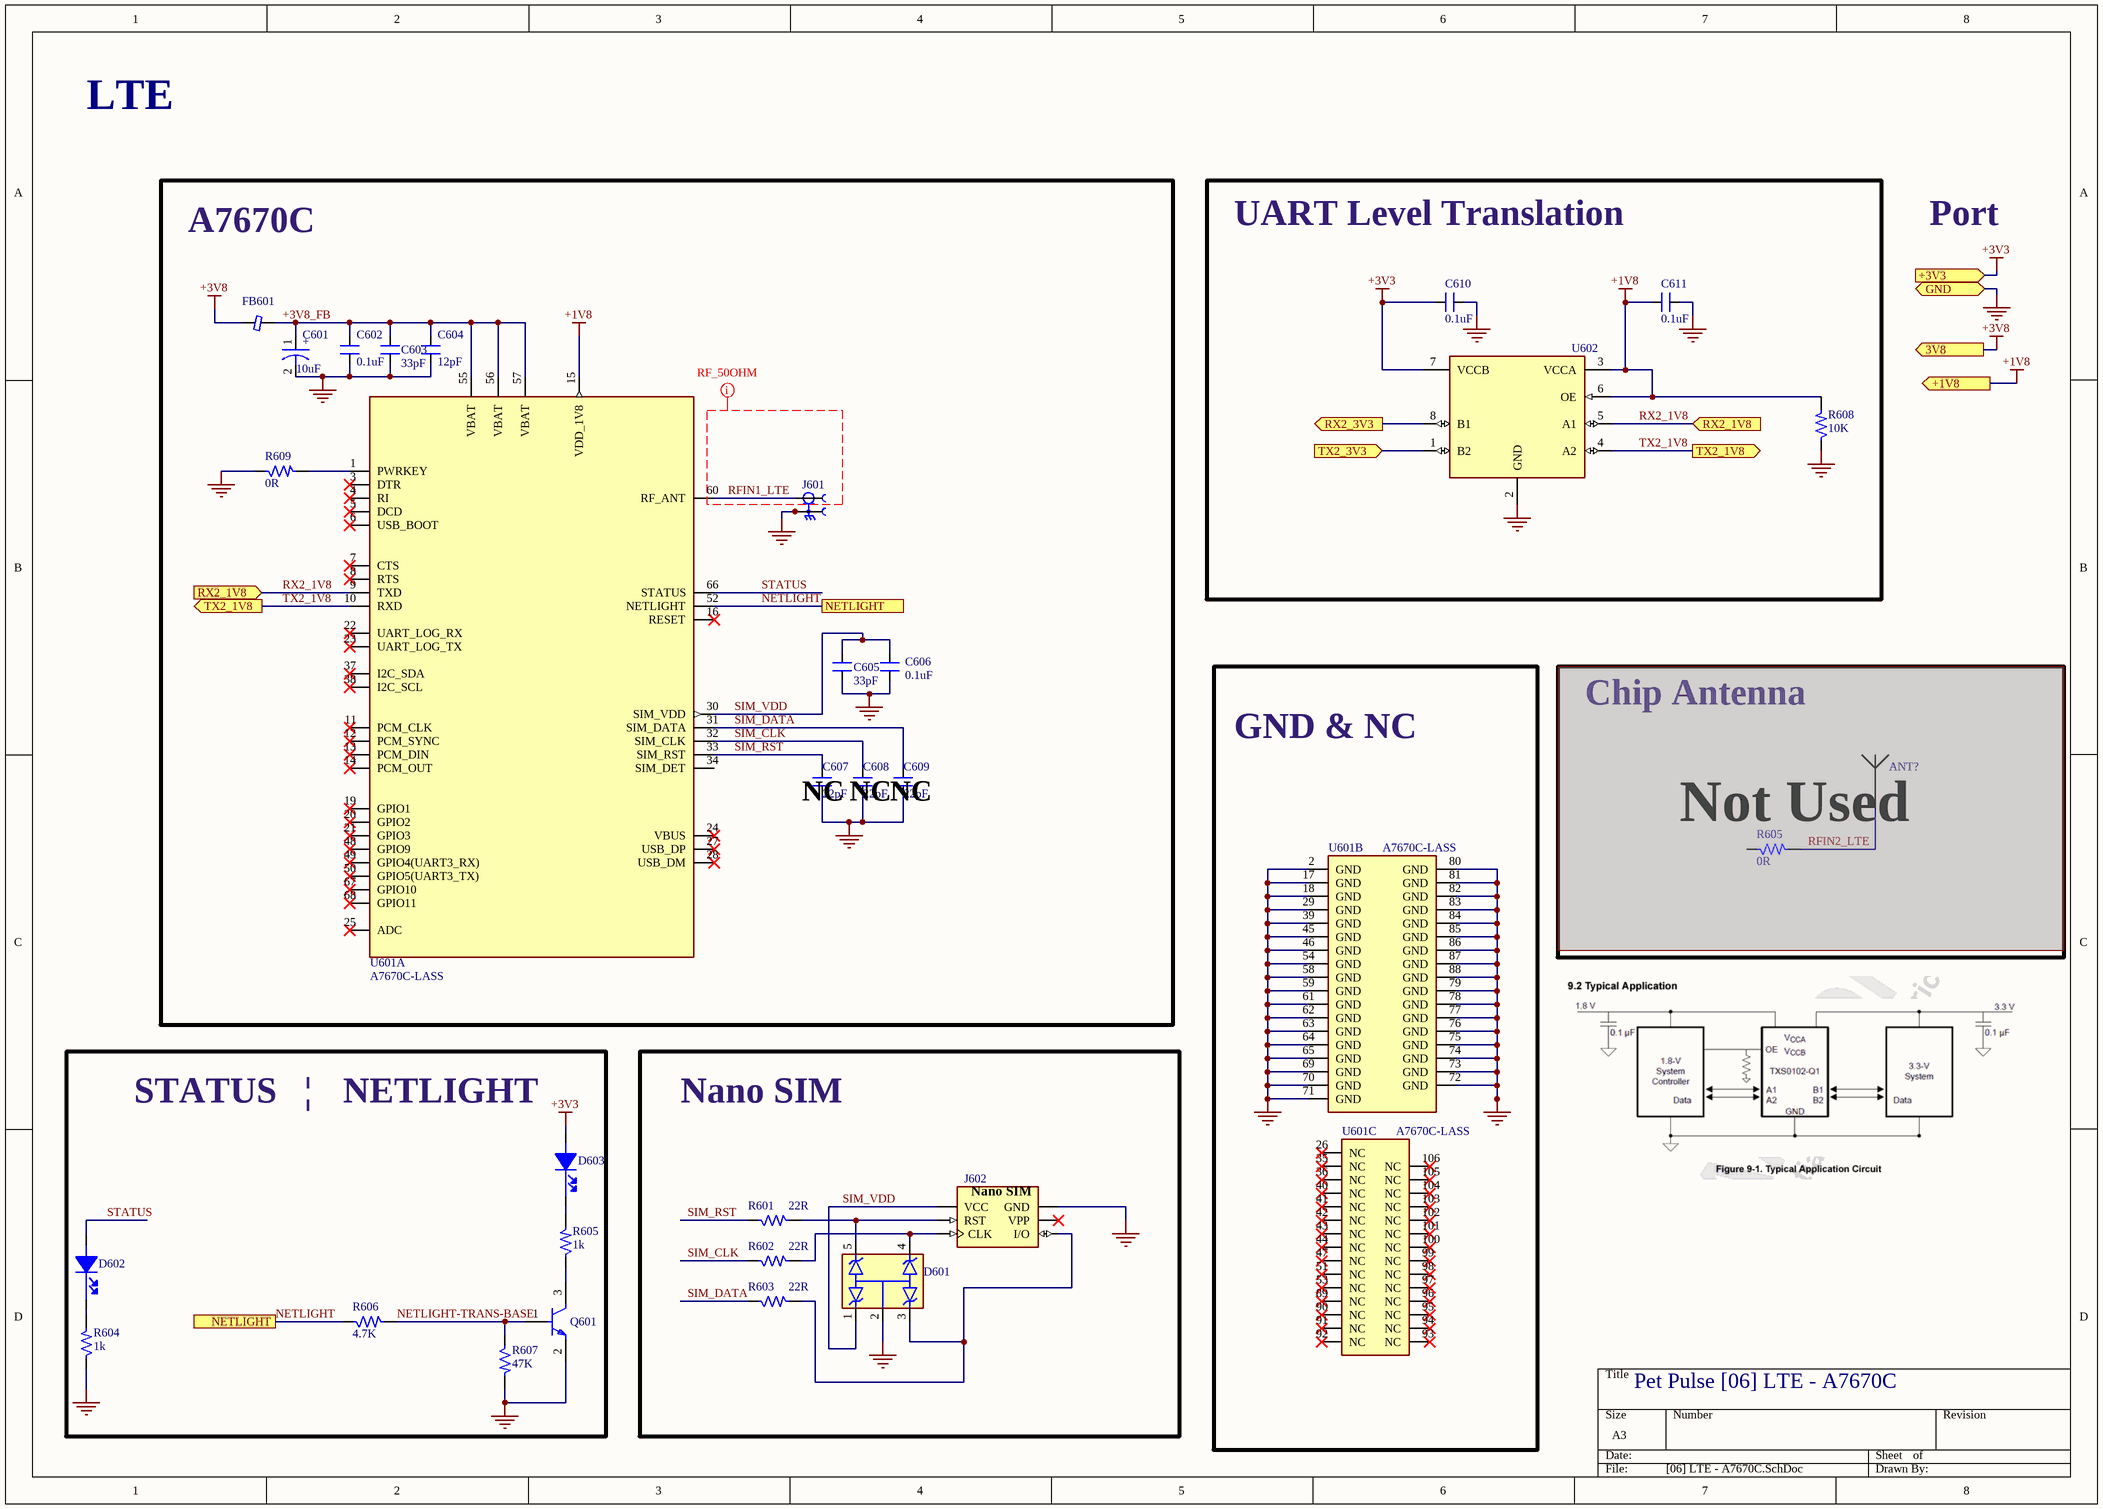
[diagram p6: [06] LTE - A7670C.SchDoc]

### Parts
(Parts that share a designator on the sheet are numbered #1, #2 ... from top to bottom, then left to right.)
ANT?  NN02-201  [ANT_Ignion_NN02-201]  (value not drawn)  (masked out: inside a compile mask, not in the netlist)
C601  10uF  [CAP-T_1206]
C602  0.1uF  [CAP_0805]
C603  33pF  [CAP_0805]
C604  12pF  [CAP_0805]
C605  33pF  [CAP_0805]
C606  0.1uF  [CAP_0805]
C607  22pF  [CAP_0805]
C608  22pF  [CAP_0805]
C609  22pF  [CAP_0805]
C610  0.1uF  [CAP_0805]
C611  0.1uF  [CAP_0805]
D601  ESDA6V1W5  [SOT-323-5]  (value not drawn)
D602  LED 0805 ORANGE  [LED_0805]  (value not drawn)
D603  LED 0805 ORANGE  [LED_0805]  (value not drawn)
FB601  MPZ2012S221AT000  [FB_0805]  (value not drawn)
J601  CON_UFL-SMD-T  [CON-UFL-SMD-T]  (value not drawn)
J602  SIM8051-6-0-14-01-A  [GCT_SIM8051-6-0-14-01-X-REVD]  (value not drawn)
Q601  MMBT3904-7-F  [FP-SOT23-MFG]  (value not drawn)
R601  22R  [RES_0805]
R602  22R  [RES_0805]
R603  22R  [RES_0805]
R604  1k  [RES_0805]
R605#1  0R  [RES_0603]  (masked out: inside a compile mask, not in the netlist)
R605#2  1k  [RES_0805]
R606  4.7K  [RES_0805]
R607  47K  [RES_0805]
R608  10K  [RES_0805]
R609  0R  [RES_0603]
U601  A7670C-LASS  [LTE_CHIP_A7670C-LASS]  (parts A,B,C of 3)
U602  TXS0102DCTR  [SOP65P400X130-8N]  (value not drawn)

### Blocks framed on the sheet
A7670C: C601-C609 FB601 J601 R609 U601
UART Level Translation: C610 C611 R608 U602
GND & NC: U601
Not Used: ANT? R605#1
Nano SIM: D601 J602 R601-R603

### Ports
3V8 (out, see [02] LDO and LiPo Circuit[4A], [05] External Modules[4A]), +1V8 (out, see [05] External Modules[4A]), +3V3 (in, see [02] LDO and LiPo Circuit[4A], [03] ESP32[2C], [04] GPS[4A], [05] External Modules[4A]), GND (bidir, see [02] LDO and LiPo Circuit[4A], [03] ESP32[2C], [04] GPS[4A], [05] External Modules[4A]), NETLIGHT (see [06] LTE - A7670C[1D]), NETLIGHT (see [06] LTE - A7670C[4B]), RX2_1V8 (in, see [06] LTE - A7670C[1B]), RX2_1V8 (in, see [06] LTE - A7670C[7B]), RX2_3V3 (out, see [03] ESP32[4B]), TX2_1V8 (out, see [06] LTE - A7670C[1B]), TX2_1V8 (out, see [06] LTE - A7670C[7B]), TX2_3V3 (in, see [03] ESP32[4B])

### Nets
+1V8: C611.2 R608.2 U601.15(VDD_1V8) U602.3(VCCA) U602.6(OE) ; port +1V8
+3V3: C610.2 D603.2(Anode) U602.7(VCCB) ; port +3V3
+3V8: FB601.1 ; port 3V8
GND: C601.2 C602.1 C603.1 C604.1 C605.1 C606.1 C607.1 C608.1 C609.1 C610.1 C611.1 D601.2 J601.2 J601.3 J602.C5(GND) Q601.2(E) R604.1 R607.2 R608.1 R609.1 U601.2(GND) U601.17(GND) U601.18(GND) U601.29(GND) U601.39(GND) U601.45(GND) U601.46(GND) U601.54(GND) U601.58(GND) U601.59(GND) U601.61(GND) U601.62(GND) U601.63(GND) U601.64(GND) U601.65(GND) U601.69(GND) U601.70(GND) U601.71(GND) U601.72(GND) U601.73(GND) U601.74(GND) U601.75(GND) U601.76(GND) U601.77(GND) U601.78(GND) U601.79(GND) U601.80(GND) U601.81(GND) U601.82(GND) U601.83(GND) U601.84(GND) U601.85(GND) U601.86(GND) U601.87(GND) U601.88(GND) U602.2(GND) ; port GND
+3V8_FB: C601.1 C602.2 C603.2 C604.2 FB601.2 U601.55(VBAT) U601.56(VBAT) U601.57(VBAT)
NETLIGHT: R606.1 U601.52(NETLIGHT) ; port NETLIGHT
NETLIGHT-TRANS-BASE: Q601.1(B) R606.2 R607.1
RFIN1_LTE: J601.1 U601.60(RF_ANT)
RX2: U602.8(B1) ; port RX2_3V3
RX2_1V8: U601.9(TXD) U602.5(A1) ; port RX2_1V8
SIM_CLK: C608.2 R602.1 U601.32(SIM_CLK)
SIM_DATA: C609.2 R603.1 U601.31(SIM_DATA)
SIM_RST: C607.2 R601.1 U601.33(SIM_RST)
SIM_VDD: C605.2 C606.2 D601.1 J602.C1(VCC) U601.30(SIM_VDD)
STATUS: D602.2(Anode) U601.66(STATUS)
TX2: U602.1(B2) ; port TX2_3V3
TX2_1V8: U601.10(RXD) U602.4(A2) ; port TX2_1V8
NetD601_3: D601.3 J602.C7(I/O) R603.2
NetD601_4: D601.4 J602.C3(CLK) R602.2
NetD601_5: D601.5 J602.C2(RST) R601.2
NetD602_1: D602.1(Cathode) R604.2
NetD603_1: D603.1(Cathode) R605#2.2
NetQ601_3: Q601.3(C) R605#2.1
NetR609_2: R609.2 U601.1(PWRKEY)

Not connected (* = marked no-connect by the designer): J602 C6(VPP)*; U601 3(DTR)* 4(RI)* 5(DCD)* 6(USB_BOOT)* 7(CTS)* 8(RTS)* 11(PCM_CLK)* 12(PCM_SYNC)* 13(PCM_DIN)* 14(PCM_OUT)* 16(RESET)* 19(GPIO1)* 20(GPIO2)* 21(GPIO3)* 22(UART_LOG_RX)* 23(UART_LOG_TX)* 24(VBUS)* 25(ADC)* 26(NC)* 27(USB_DP)* 28(USB_DM)* 34(SIM_DET) 35(NC)* 36(NC)* 37(I2C_SDA)* 38(I2C_SCL)* 40(NC)* 41(NC)* 42(NC)* 43(NC)* 44(NC)* 47(NC)* 48(GPIO9)* 49(GPIO4(UART3_RX))* 50(GPIO5(UART3_TX))* 51(NC)* 53(NC)* 67(GPIO10)* 68(GPIO11)* 89(NC)* 90(NC)* 91(NC)* 92(NC)* 93(NC)* 94(NC)* 95(NC)* 96(NC)* 97(NC)* 98(NC)* 99(NC)* 100(NC)* 101(NC)* 102(NC)* 103(NC)* 104(NC)* 105(NC)* 106(NC)*

### Layout directives
net class RF_50: RFIN1_LTE

### Notes on the sheet
- LTE
- Port
- Chip Antenna
- (near C607) NC
- (near C608) NC
- (near C609) NC
- STATUS   |
- NETLIGHT
- Pet Pulse [06] LTE - A7670C
- (in symbol CAP-P_10uF-16V-10%-1206) +
- (in symbol CON_NanoSIM_6Pin_SIM8051-6-0-14-01-A) Nano SIM

### Library data of the parts
ANT? = ANT-CHIP_Cellular_UltraWideBand_Ignion_NN02-201: ONE MXTEND MULTIBAND ANTENNA; Manufacturer: Ignion; Manufacturer Part Number: NN02-201; Case/Package: SMD
C601 = CAP-P_10uF-16V-10%-1206: as C304 on sheet [03] ESP32; Case/Package: 1206; Supplier-1: SIRICOM; Supplier Part Number-1: TAJA106K016SNJ
C602 C606 C610 C611 = CAP_0.1uF-50V-10%-0805: as C301 on sheet [03] ESP32; Case/Package: 0805; Supplier-1: SIRICOM; Supplier Part Number-1: 0805B104K500CT
C603 C605 = CAP_33pF-50V-5%-0805: 33pF ±5% 50V Ceramic Capacitor C0G/NPO 0805 (2012 Metric); Manufacturer: YAGEO; Manufacturer Part Number: CC0805JRNPO9BN330; Alternate Part Number-1: NA; Case/Package: 0805
C604 = CAP_12pF-50V-5%-0805: 12pF ±5% 50V Ceramic Capacitor C0G, NP0 0805 (2012 Metric); Manufacturer: KEMET; Manufacturer Part Number: CC0805JRNPO9BN120; Alternate Part Number-1: NA; Case/Package: 0805; Supplier-1: SIRICOM; Supplier Part Number-1: 0805N120J500CT
C607-C609 = CAP_22PF-50V-5%-0805: 22pF ±5% 50V Ceramic Capacitor C0G, NP0 0805 (2012 Metric); Manufacturer: Yageo; Manufacturer Part Number: CC0805JRNPO9BN220; Alternate Part Number-1: 0805CG220J500NT; Case/Package: 0805; Supplier-1: SIRICOM; Supplier Part Number-1: 0805N220J500CT
D601 = DIO_TVS_ARRY_3Vrm_6.1Vbr_ESDA6V1W5: as D203 on sheet [02] LDO and LiPo Circuit; Manufacturer Part Number: ESDA6V1W5; Case/Package: SOT-323-5
D602 D603 = LED_ORANGE-2V-20mA- 0805: as D201 on sheet [02] LDO and LiPo Circuit; Supplier 1: Arrow Electronics; RoHS: Yes; Category: LEDs; Stock 1: 2418; Pricing 1: 1=0.27100, 10=0.15400, 25=0.15270, 100=0.07290, 250=0.07210, 500=0.06600, 1000=0.05150 (USD); Mount: Surface Mount; Case/Package: 0805; Number of Pins: 2; Color: Orange; Case Code (Metric): 2012; Case Code (Imperial): 0805; Contact Plating: Tin,Matte; Min Operating Temperature: -30°C; Max Operating Temperature: 85°C; Packaging: Tape and Reel; Forward Voltage: 2V; Test Current: 20mA; Package Quantity: 16000; Illumination Color: Orange; Series: CHIPLED 0805; Length: 2mm; Width: 1.25mm; Height: 0.9mm; Radiation Hardening: No; RoHS Compliant: Yes; ComponentLink1URL: https://datasheet.ciiva.com/2119/00078881-0-2119287.pdf?src-supplier=Digi-Key; ComponentLink1Description: https://datasheet.ciiva.com/2119/00078881-0-2119287.pdf?src-supplier=Digi-Key; ComponentLink2URL: https://datasheet.ciiva.com/2119/00078881-0-2119286.pdf?src-supplier=Digi-Key; ComponentLink2Description: https://datasheet.ciiva.com/2119/00078881-0-2119286.pdf?src-supplier=Digi-Key; ComponentLink3URL: https://datasheet.ciiva.com/2119/00078881-0-2119288.pdf?src-supplier=Digi-Key; ComponentLink3Description: https://datasheet.ciiva.com/2119/00078881-0-2119288.pdf?src-supplier=Digi-Key; Supplier Part Number 1: LO R976-PS-1
FB601 = FB_220 OHM-100Mhz_3A_0805_MPZ2012S221AT000: Ferrite bead 220 Ohms @ 100 MHz 0805 (2012 Metric) 3A 40mOhm; Manufacturer: TDK Corporation; Manufacturer Part Number: MPZ2012S221AT000; Case/Package: 0805
J601 = CON_UFL-SMD-T: as J401 on sheet [04] GPS; Price: None; Package: None; Value: *; Check_prices: https://www.snapeda.com/parts/CONUFL001-SMD-T/Linx/view-part/?ref=eda; Availability: Unavailable; SnapEDA_Link: https://www.snapeda.com/parts/CONUFL001-SMD-T/Linx/view-part/?ref=snap
J602 = CON_NanoSIM_6Pin_SIM8051-6-0-14-01-A: 6 Position Card Connector NANO SIM Surface Mount, Right Angle Gold; Manufacturer: GCT; Manufacturer Part Number: SIM8051-6-0-14-01-A; Case/Package: SMT
Q601 = TRANS_NPN_MMBT3904: as Q301 on sheet [03] ESP32; Contact Plating: Tin; Package Quantity: 3000; Max Frequency: 300MHz; REACH SVHC: No SVHC; Max Operating Temperature: 150°C; Width: 1.4mm; Collector Emitter Voltage (VCEO): 40V; Voltage Rating (DC): 40V; Radiation Hardening: No; Case/Package: SOT-23; Height: 1mm; Collector Emitter Breakdown Voltage: 40V; Length: 3.05mm; Polarity: NPN; Packaging: Tape and Reel; Number of Pins: 3; Min Operating Temperature: -55°C; Gain Bandwidth Product: 300MHz; Mount: Surface Mount; Weight: 0.000282oz; Continuous Collector Current: 200mA; Transition Frequency: 300MHz; Max Breakdown Voltage: 40V; Lead Free: Lead Free; Manufacturer Part Number: MMBT3904-7-F
R601-R603 = RES_22R-0.125W-5%-0805: 22 Ohms ±5% 0.125W, 1/8W Chip Resistor 0805 (2012 Metric) Moisture Resistant Thick Film; Manufacturer: Stackpole Electronics; Manufacturer Part Number: RC0805JR-0722RL; Alternate Part Number-1: NA; Case/Package: 0805; Supplier-1: SIRICOM; Supplier Part Number-1: WR08X30R0FTL
R604 R605#2 = RES_1K- 0.125W-5%-0805: as R201 on sheet [02] LDO and LiPo Circuit; Case/Package: 0805
R605#1 R609 = RES_0R-0.1W-0603: as R402 on sheet [04] GPS; Case/Package: 0603; Supplier-1: Digi-Key; Supplier Part Number-1: RMCF0603ZT0R00CT-ND
R606 = RES_4.7K-0.125W-1%-0805: 4.7 kOhms ±1% 0.125W, 1/8W Chip Resistor 0805 (2012 Metric) Moisture Resistant Thick Film; Manufacturer: YAGEO; Manufacturer Part Number: RC0805FR-074K7L; Case/Package: 0805
R607 = RES_47K-0.125W-1%-0805: as R205 on sheet [02] LDO and LiPo Circuit; Case/Package: 0805
R608 = RES_10K-0.125W-1%-0805: as R303 on sheet [03] ESP32; Case/Package: 0805; Supplier-1: SIRICOM; Supplier Part Number-1: WR08X1002FTL; Alternate Part Number-1: WR08X1002FTL
U601 = MOD_LTE_CHIP_A7670C-LASS: Manufacturer: SimCom; Manufacturer Part Number: Self-Procurred
U602 = IC_LEV-TRANS-2BIT_TXS0102DCTR: 2-Bit Bidirectional Voltage-Level Shifter for Open-Drain and Push-Pull Application 8-SM8 -40 to 85; MF: Texas Instruments; Value: *; Price: None; Package: SSOP-8 Texas Instruments; SnapEDA_Link: https://www.snapeda.com/parts/TXS0102DCTR/Texas%20Instruments/view-part/46770/?ref=snap; Availability: Unavailable; Texas_Instruments-Purchase-URL: https://snapeda.com/shop?store=Texas+Instruments&id=46770; MP: TXS0102DCTR; Manufacturer: Texas Instruments; Manufacturer Part Number: TXS0102DCTR; Case/Package: SM8

## Nets that join several sheets
+3V3: [02] LDO and LiPo Circuit (6 pins), [03] ESP32 (9 pins), [04] GPS (5 pins), [05] External Modules (C501.2 C502.2 J501.1 J502.1), [06] LTE - A7670C (C610.2 D603.2 U602.7)
+3V8: [02] LDO and LiPo Circuit (C210.1 R204.2 U203.4), [06] LTE - A7670C (FB601.1)
GND: [02] LDO and LiPo Circuit (34 pins), [03] ESP32 (25 pins), [04] GPS (9 pins), [05] External Modules (5 pins), [06] LTE - A7670C (56 pins)
ACCL_X: [03] ESP32 (U301.10), [05] External Modules (J501.2)
ACCL_Y: [03] ESP32 (U301.11), [05] External Modules (J501.3)
ACCL_Z: [03] ESP32 (U301.12), [05] External Modules (J501.4)
I2C_SCL: [03] ESP32 (R308.2 U301.36), [04] GPS (U401.19), [05] External Modules (J502.3)
I2C_SDA: [03] ESP32 (R309.2 U301.33), [04] GPS (U401.18), [05] External Modules (J502.4)
RX2: [03] ESP32 (U301.27), [06] LTE - A7670C (U602.8)
TX2: [03] ESP32 (U301.28), [06] LTE - A7670C (U602.1)
USB_D_N: [02] LDO and LiPo Circuit (D203.4 J201.2), [03] ESP32 (U302.6)
USB_D_P: [02] LDO and LiPo Circuit (D203.5 J201.3), [03] ESP32 (U302.5)